# Altium project Placa.PrjPcb
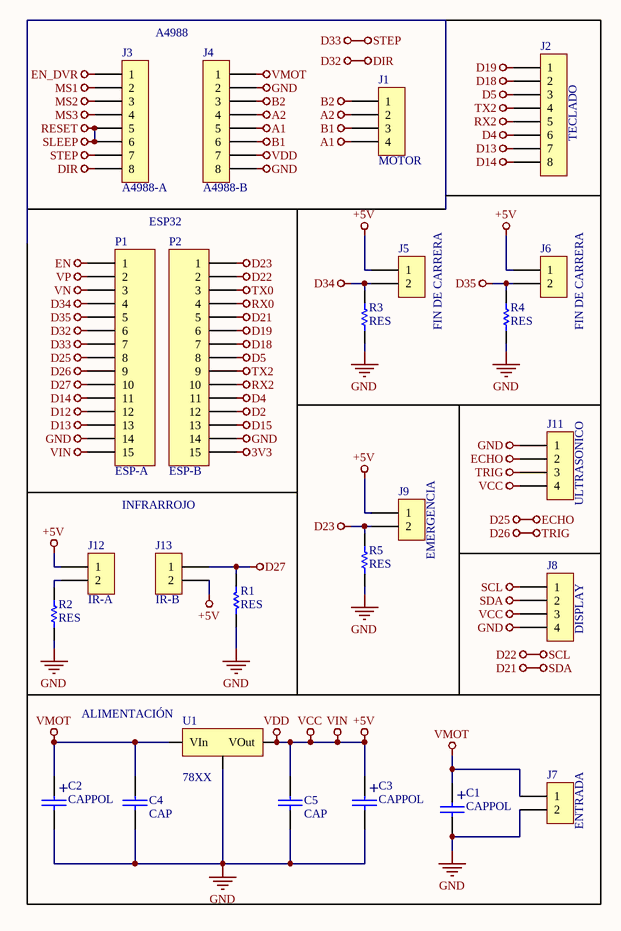
[diagram p0: esquema.SchDoc]
1 sheet, 25 parts. Net scope: global (net labels, ports and power ports of the same name join across sheets).
Board file: PCB.PcbDoc

## Sheet esquema.SchDoc
size A4; SheetNumber: 1; SheetTotal: 1

### Parts
C1  CAPPOL  [CAP100RP2]
C2  CAPPOL  [CAP100RP]
C3  CAPPOL  [CAP100RP]
C4  CAP  [CAP200]
C5  CAP  [CAP200]
J1  MOTOR  [SIP4]
J2  TECLADO  [SIP8]
J3  A4988-A  [SIP8]
J4  A4988-B  [SIP8]
J5  FIN DE CARRERA  [SIP2]
J6  FIN DE CARRERA  [SIP2]
J7  ENTRADA  [BORNERA2]
J8  DISPLAY  [SIP4]
J9  EMERGENCIA  [SIP2]
J11  ULTRASONICO  [SIP4]
J12  IR-A  [SIP2]
J13  IR-B  [SIP2]
P1  ESP-A  [HDR1X15]
P2  ESP-B  [HDR1X15]
R1  RES  [RES400]
R2  RES  [RES400]
R3  RES  [RES400]
R4  RES  [RES400]
R5  RES  [RES400]
U1  78XX  [TO-220 V]

### Blocks framed on the sheet
ESP32: P1 P2
INFRARROJO: J12 J13 R1 R2

### Nets
3V3: P2.15
+5V: C3.1 C5.1 J4.7 J5.1 J6.1 J8.3 J9.1 J11.4 J12.1 J13.2 P1.15 U1.3(VOut)  [also labelled VCC, VDD, VIN]
A1: J1.4 J4.5
A2: J1.2 J4.4
B1: J1.3 J4.6
B2: J1.1 J4.3
D2: P2.12
D4: J2.6 P2.11
D5: J2.3 P2.8
D12: P1.12
D13: J2.7 P1.13
D14: J2.8 P1.11
D15: P2.13
D18: J2.2 P2.7
D19: J2.1 P2.6
D21: J8.2 P2.5  [also labelled SDA]
D22: J8.1 P2.2  [also labelled SCL]
D23: J9.2 P2.1 R5.2
D25: J11.2 P1.8  [also labelled ECHO]
D26: J11.3 P1.9  [also labelled TRIG]
D27: J13.1 P1.10 R1.2
D32: J3.8 P1.6  [also labelled DIR]
D33: J3.7 P1.7  [also labelled STEP]
D34: J5.2 P1.4 R3.2
D35: J6.2 P1.5 R4.2
EN: P1.1
EN_DVR: J3.1
GND: C1.2 C2.2 C3.2 C4.2 C5.2 J4.2 J4.8 J7.2 J8.4 J11.1 P1.14 P2.14 R1.1 R2.1 R3.1 R4.1 R5.1 U1.2(GND)
MS1: J3.2
MS2: J3.3
MS3: J3.4
RESET: J3.5 J3.6  [also labelled SLEEP]
RX0: P2.4
RX2: J2.5 P2.10
TX0: P2.3
TX2: J2.4 P2.9
VMOT: C1.1 C2.1 C4.1 J4.1 J7.1 U1.1(VIn)
VN: P1.3
VP: P1.2
NetJ12_2: J12.2 R2.2

### Notes on the sheet
- A4988
- (near U1) ALIMENTACIÓN
- (in symbol CAPPOL) +

### Library data of the parts
J1 J8 J11 = CON4
J2-J4 = CON8
J5 J6 J9 J12 J13 = CON2
J7 = BORNERA 2
P1 P2 = Header 15: Header, 15-Pin; LatestRevisionDate: 17-Jul-2002; LatestRevisionNote: Re-released for DXP Platform.; Publisher: Altium Limited
U1 = 78XX: REGULDOR POSITIVO